# Altium schematic sheet H19R1_Frontend 2.SchDoc
size Letter; CompanyName: Hexabitz; DocumentNumber: 2; SheetNumber: 2; SheetTotal: 3
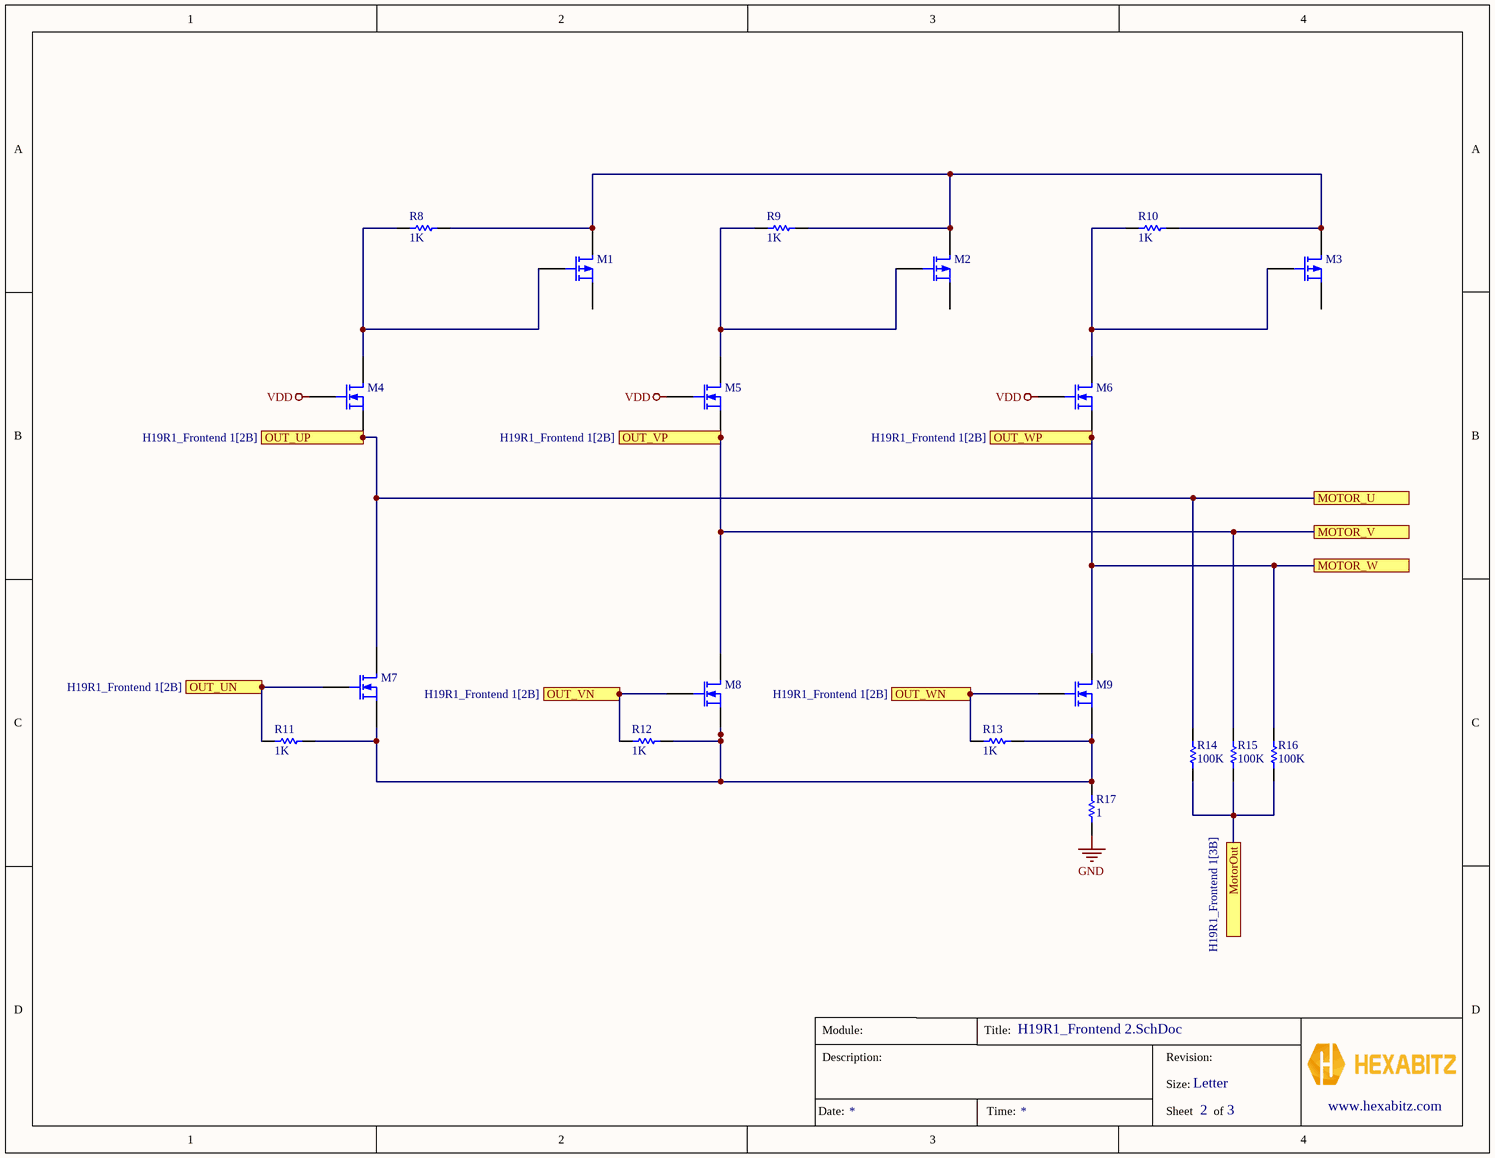
[diagram p0: H19R1_Frontend 2.SchDoc]

## Parts
M1  P-channel Power MOSFET VDMOS Model  (value not drawn)
M2  P-channel Power MOSFET VDMOS Model  (value not drawn)
M3  P-channel Power MOSFET VDMOS Model  (value not drawn)
M4  N-channel Power MOSFET VDMOS Model  (value not drawn)
M5  N-channel Power MOSFET VDMOS Model  (value not drawn)
M6  N-channel Power MOSFET VDMOS Model  (value not drawn)
M7  N-channel Power MOSFET VDMOS Model  (value not drawn)
M8  N-channel Power MOSFET VDMOS Model  (value not drawn)
M9  N-channel Power MOSFET VDMOS Model  (value not drawn)
R8  value 1K  (hidden comment: Resistor)
R9  value 1K  (hidden comment: Resistor)
R10  value 1K  (hidden comment: Resistor)
R11  value 1K  (hidden comment: Resistor)
R12  value 1K  (hidden comment: Resistor)
R13  value 1K  (hidden comment: Resistor)
R14  value 100K  (hidden comment: Resistor)
R15  value 100K  (hidden comment: Resistor)
R16  value 100K  (hidden comment: Resistor)
R17  value 1  (hidden comment: Resistor)

## Ports
MOTOR_U, MOTOR_V, MOTOR_W, MotorOut (see H19R1_Frontend 1[3B]), OUT_UN (see H19R1_Frontend 1[2B]), OUT_UP (see H19R1_Frontend 1[2B]), OUT_VN (see H19R1_Frontend 1[2B]), OUT_VP (see H19R1_Frontend 1[2B]), OUT_WN (see H19R1_Frontend 1[2B]), OUT_WP (see H19R1_Frontend 1[2B])

## Nets
GND: R17.1
VDD: M4.2(G) M5.2(G) M6.2(G)
MOTOR_U: M4.3(S) M7.1(D) R14.2 ; port OUT_UP, port MOTOR_U
MOTOR_V: M5.3(S) M8.1(D) R15.2 ; port OUT_VP, port MOTOR_V
MOTOR_W: M6.3(S) M9.1(D) R16.2 ; port OUT_WP, port MOTOR_W
MotorOut: R14.1 R15.1 R16.1 ; port MotorOut
OUT_UN: M7.2(G) R11.1 ; port OUT_UN
OUT_VN: M8.2(G) R12.1 ; port OUT_VN
OUT_WN: M9.2(G) R13.1 ; port OUT_WN
NetM1_1: M1.1(D) M2.1(D) M3.1(D) R8.2 R9.2 R10.2
NetM1_2: M1.2(G) M4.1(D) R8.1
NetM2_2: M2.2(G) M5.1(D) R9.1
NetM3_2: M3.2(G) M6.1(D) R10.1
NetM7_3: M7.3(S) M8.3(S) M9.3(S) R11.2 R12.2 R13.2 R17.2

Not connected (* = marked no-connect by the designer): M1 3(S); M2 3(S); M3 3(S)

## Notes on the sheet
- Module:
- Title:
- Description:
- Size:
- Revision:
- Letter
- www.hexabitz.com
- Date:
- Time:
- Sheet
- of

## Library data of the parts
M1-M3 = MOSFET P-ch VDMOS: XTI: 0; A: 1; BV: 1e30; EG: 1.11; FC: 0.5; IBV: 1e-10; IS: 1e-14; PHI: 0.6; TNOM: 27; VJ: 0.8; SimulationGenericComponent: True; CGDMAX: 0; CGDMIN: 0; CGS: 0; CJO: 0; KP: 1; KSUBTHRES: 0; LAMBDA: 0; M: 0.5; MTRIODE: 1; N: 1; NBV: 1; NCHAN: 1; PCHAN: 1; RB: 0; RD: 0; RDS: 1e30; RG: 0; RQ: 0; RS: 0; SUBSHIFT: 0; SUBSLOPE: 0; THETA: 0; TT: 0; VQ: 0; VTO: 0
M4-M9 = MOSFET N-ch VDMOS: XTI: 0; A: 1; BV: 1e30; EG: 1.11; FC: 0.5; IBV: 1e-10; IS: 1e-14; PHI: 0.6; TNOM: 27; VJ: 0.8; SimulationGenericComponent: True; CGDMAX: 0; CGDMIN: 0; CGS: 0; CJO: 0; KP: 1; KSUBTHRES: 0; LAMBDA: 0; M: 0.5; MTRIODE: 1; N: 1; NBV: 1; NCHAN: 1; RB: 0; RD: 0; RDS: 1e30; RG: 0; RQ: 0; RS: 0; SUBSHIFT: 0; SUBSLOPE: 0; THETA: 0; TT: 0; VQ: 0; VTO: 0
R8-R17 = Resistor: TC1: 0; SimulationGenericComponent: True; TC2: 0